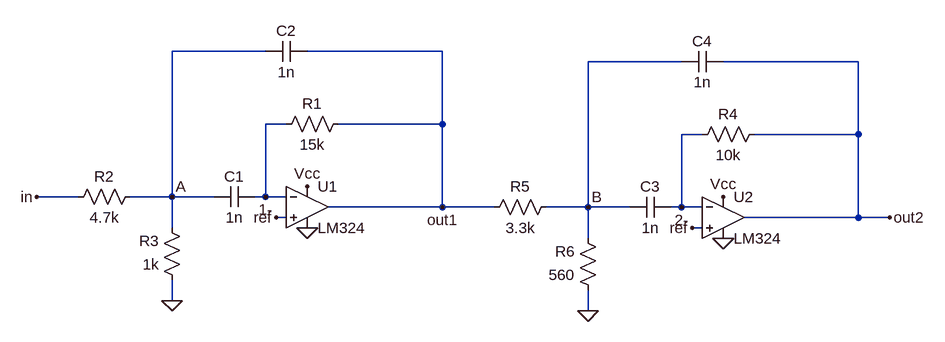
[diagram p0: schematic clean_circuit.asc]
clean_circuit.asc, the LTspice schematic file:
Version 4
SHEET 1 880 680
WIRE -160 -80 -304 -80
WIRE 112 -80 -96 -80
WIRE 480 -64 336 -64
WIRE 752 -64 544 -64
WIRE -128 32 -160 32
WIRE 112 32 112 -80
WIRE 112 32 -48 32
WIRE 512 48 480 48
WIRE 752 48 752 -64
WIRE 752 48 592 48
WIRE -448 144 -512 144
WIRE -304 144 -304 -80
WIRE -304 144 -368 144
WIRE -240 144 -304 144
WIRE -160 144 -160 32
WIRE -160 144 -176 144
WIRE -128 144 -160 144
WIRE 112 160 112 32
WIRE 112 160 -64 160
WIRE 192 160 112 160
WIRE 336 160 336 -64
WIRE 336 160 272 160
WIRE 400 160 336 160
WIRE 480 160 480 48
WIRE 480 160 464 160
WIRE 512 160 480 160
WIRE -128 176 -144 176
WIRE 752 176 752 48
WIRE 752 176 576 176
WIRE 800 176 752 176
WIRE -304 192 -304 144
WIRE 512 192 496 192
WIRE 336 208 336 160
WIRE -304 304 -304 272
WIRE 336 320 336 288
FLAG -96 192 0
FLAG -96 128 Vcc
FLAG -304 304 0
FLAG 544 208 0
FLAG 544 144 Vcc
FLAG 336 320 0
FLAG 800 176 out2
FLAG 112 160 out1
FLAG -144 176 ref
FLAG 496 192 ref
FLAG -304 144 A
FLAG 336 160 B
FLAG -160 144 1-
FLAG 480 160 2-
FLAG -512 144 in
SYMBOL OpAmps\\opamp2 -96 96 R0
SYMATTR InstName U1
SYMATTR Value LM324
SYMBOL cap -176 128 R90
WINDOW 0 0 32 VBottom 2
WINDOW 3 32 32 VTop 2
SYMATTR InstName C1
SYMATTR Value 1n
SYMBOL cap -96 -96 R90
WINDOW 0 0 32 VBottom 2
WINDOW 3 32 32 VTop 2
SYMATTR InstName C2
SYMATTR Value 1n
SYMBOL res -32 16 R90
WINDOW 0 0 56 VBottom 2
WINDOW 3 32 56 VTop 2
SYMATTR InstName R1
SYMATTR Value 15k
SYMBOL res -352 128 R90
WINDOW 0 0 56 VBottom 2
WINDOW 3 32 56 VTop 2
SYMATTR InstName R2
SYMATTR Value 4.7k
SYMBOL res -288 288 R180
WINDOW 0 36 76 Left 2
WINDOW 3 36 40 Left 2
SYMATTR InstName R3
SYMATTR Value 1k
SYMBOL OpAmps\\opamp2 544 112 R0
SYMATTR InstName U2
SYMATTR Value LM324
SYMBOL cap 464 144 R90
WINDOW 0 0 32 VBottom 2
WINDOW 3 32 32 VTop 2
SYMATTR InstName C3
SYMATTR Value 1n
SYMBOL cap 544 -80 R90
WINDOW 0 0 32 VBottom 2
WINDOW 3 32 32 VTop 2
SYMATTR InstName C4
SYMATTR Value 1n
SYMBOL res 608 32 R90
WINDOW 0 0 56 VBottom 2
WINDOW 3 32 56 VTop 2
SYMATTR InstName R4
SYMATTR Value 10k
SYMBOL res 288 144 R90
WINDOW 0 0 56 VBottom 2
WINDOW 3 32 56 VTop 2
SYMATTR InstName R5
SYMATTR Value 3.3k
SYMBOL res 352 304 R180
WINDOW 0 36 76 Left 2
WINDOW 3 36 40 Left 2
SYMATTR InstName R6
SYMATTR Value 560

The netlist it stands for:
* clean_circuit.asc
XU1 ref 1- Vcc 0 out1 LM324  ; pins In+ In- V+ V- OUT
C1 1- A 1n
C2 out1 A 1n
R1 out1 1- 15k
R2 A in 4.7k
R3 0 A 1k
XU2 ref 2- Vcc 0 out2 LM324  ; pins In+ In- V+ V- OUT
C3 2- B 1n
C4 out2 B 1n
R4 out2 2- 10k
R5 B out1 3.3k
R6 0 B 560
.backanno
.end